# Altium schematic sheet 33-SOC_GENERAL AND MCU GENERAL.SchDoc
size 513 x 386 mm
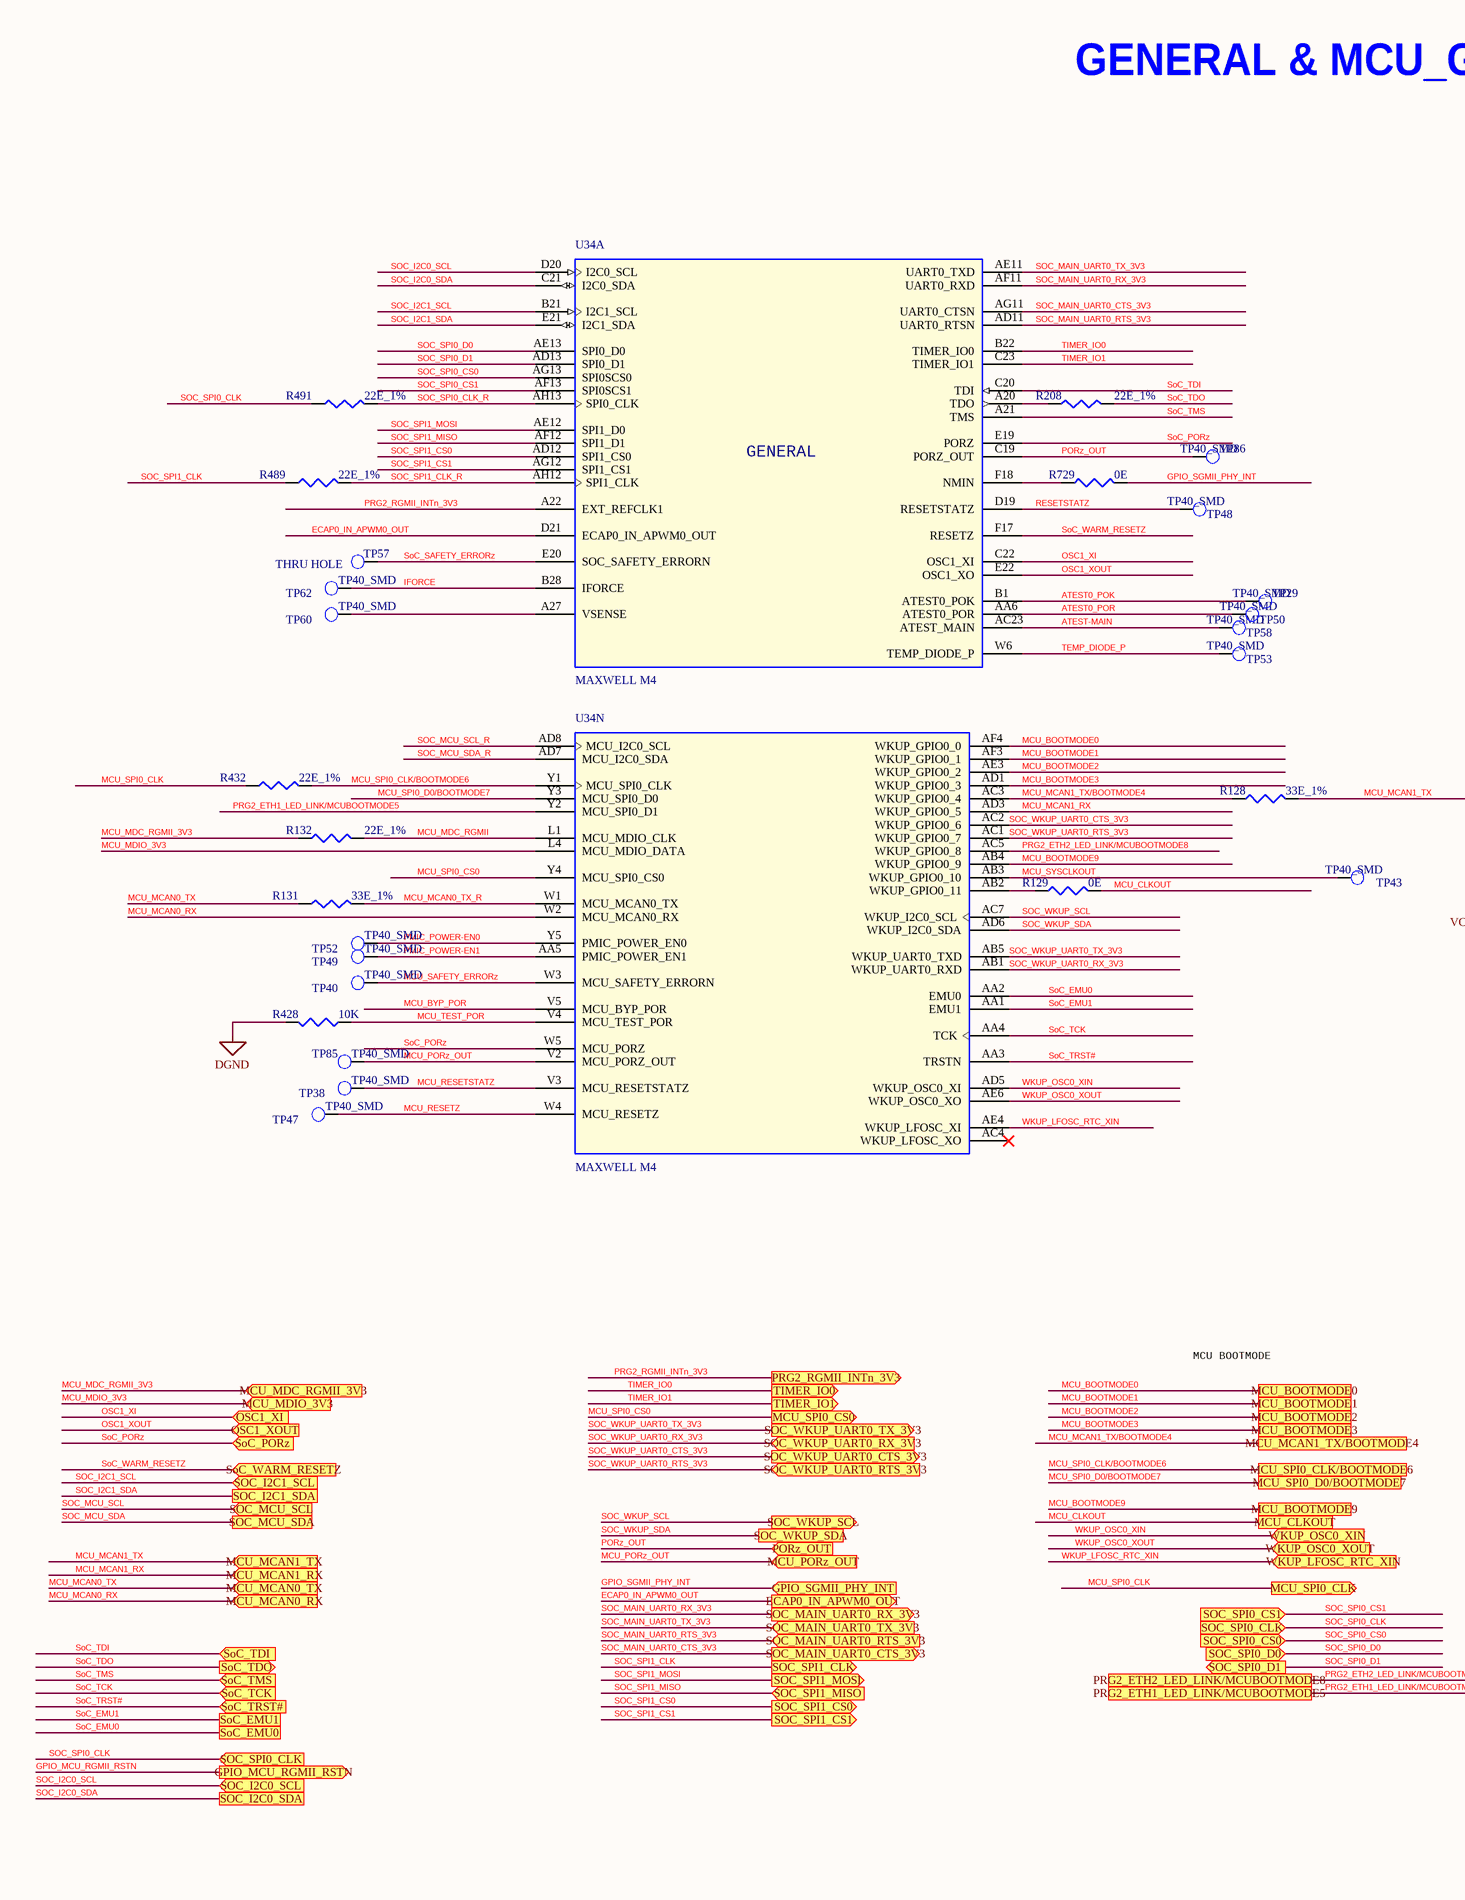
[diagram p0: 33-SOC_GENERAL AND MCU GENERAL.SchDoc, left]
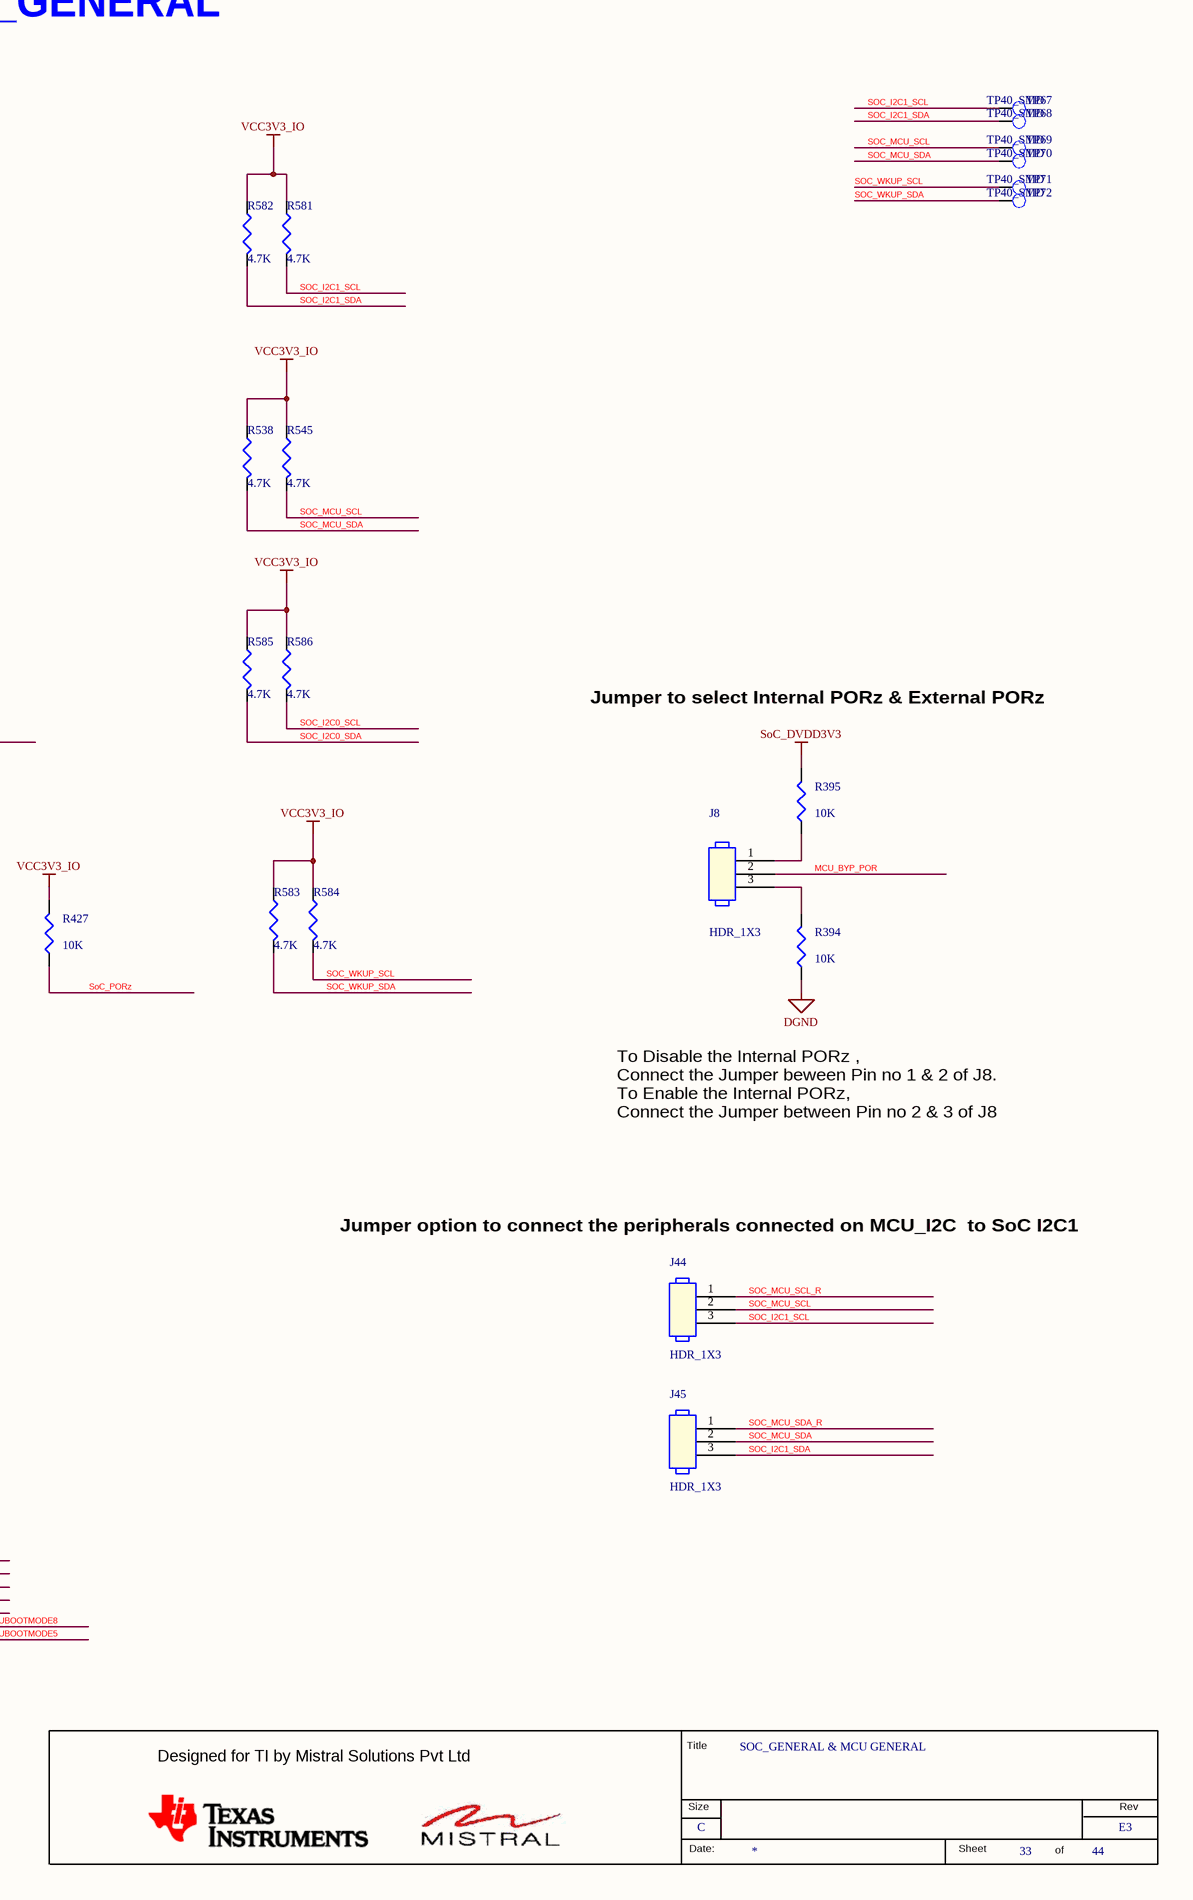
[diagram p1: 33-SOC_GENERAL AND MCU GENERAL.SchDoc, right]

## Parts
*  RevCode: E3  Title: SOC_GENERAL & MCU GENERAL  Page Size: C  Page Number: 33  Page Count: 44  (hidden comment: MISTRAL_TITLEBLK_CSIZE)  (graphical)
J8  HDR_1X3  [HDR_3X1_100_S_T]
J44  HDR_1X3  [HDR_3X1_100_S_T]
J45  HDR_1X3  [HDR_3X1_100_S_T]
R128  33E_1%  [RES0402_0-5]
R129  0E  [RES0402_0-5]
R131  33E_1%  [RES0402_0-5]
R132  22E_1%  [RES0402]
R208  22E_1%  [RES0402]
R394  10K  [RES0402_0-5]
R395  10K  [RES0402_0-5]
R427  10K  [RES0402_0-5]
R428  10K  [RES0402_0-5]
R432  22E_1%  [RES0402]
R489  22E_1%  [RES0402]
R491  22E_1%  [RES0402]
R538  4.7K  [RES0402]
R545  4.7K  [RES0402]
R581  4.7K  [RES0402]
R582  4.7K  [RES0402]
R583  4.7K  [RES0402]
R584  4.7K  [RES0402]
R585  4.7K  [RES0402]
R586  4.7K  [RES0402]
R729  0E  [RES0402_0-5]
TP29  TP40_SMD  [TP40_SMD]
TP38  TP40_SMD  [TP40_SMD]
TP40  TP40_SMD  [TP40_SMD]
TP43  TP40_SMD  [TP40_SMD]
TP47  TP40_SMD  [TP40_SMD]
TP48  TP40_SMD  [TP40_SMD]
TP49  TP40_SMD  [TP40_SMD]
TP50  TP40_SMD  [TP40_SMD]
TP52  TP40_SMD  [TP40_SMD]
TP53  TP40_SMD  [TP40_SMD]
TP57  THRU HOLE  [TP_40X65]
TP58  TP40_SMD  [TP40_SMD]
TP60  TP40_SMD  [TP40_SMD]
TP62  TP40_SMD  [TP40_SMD]
TP67  TP40_SMD  [TP40_SMD]
TP68  TP40_SMD  [TP40_SMD]
TP69  TP40_SMD  [TP40_SMD]
TP70  TP40_SMD  [TP40_SMD]
TP71  TP40_SMD  [TP40_SMD]
TP72  TP40_SMD  [TP40_SMD]
TP85  TP40_SMD  [TP40_SMD]
TP86  TP40_SMD  [TP40_SMD]
U34  MAXWELL M4  [BGA784_31-49_910X910_1-7]  (parts A,N of 19)

## Ports
ECAP0_IN_APWM0_OUT (out), GPIO_MCU_RGMII_RSTN (out), GPIO_SGMII_PHY_INT (in), MCU_BOOTMODE0, MCU_BOOTMODE1, MCU_BOOTMODE2, MCU_BOOTMODE3, MCU_BOOTMODE9, MCU_CLKOUT, MCU_MCAN0_RX (in), MCU_MCAN0_TX (in), MCU_MCAN1_RX (in), MCU_MCAN1_TX (in), MCU_MCAN1_TX/BOOTMODE4, MCU_MDC_RGMII_3V3 (in), MCU_MDIO_3V3 (in), MCU_PORz_OUT (in), MCU_SPI0_CLK (out), MCU_SPI0_CLK/BOOTMODE6, MCU_SPI0_CS0 (out), MCU_SPI0_D0/BOOTMODE7, OSC1_XI (in), OSC1_XOUT (in), PORz_OUT (in), PRG2_ETH1_LED_LINK/MCUBOOTMODE5, PRG2_ETH2_LED_LINK/MCUBOOTMODE8, PRG2_RGMII_INTn_3V3 (out), SoC_EMU0, SoC_EMU1, SOC_I2C0_SCL (in), SOC_I2C0_SDA, SOC_I2C1_SCL (in), SOC_I2C1_SDA, SOC_MAIN_UART0_CTS_3V3 (out), SOC_MAIN_UART0_RTS_3V3 (in), SOC_MAIN_UART0_RX_3V3 (out), SOC_MAIN_UART0_TX_3V3 (in), SOC_MCU_SCL (in), SOC_MCU_SDA, SoC_PORz (in), SOC_SPI0_CLK (in), SOC_SPI0_CS0 (in), SOC_SPI0_CS1 (in), SOC_SPI0_D0 (in), SOC_SPI0_D1 (out), SOC_SPI1_CLK (out), SOC_SPI1_CS0 (out), SOC_SPI1_CS1 (out), SOC_SPI1_MISO (in), SOC_SPI1_MOSI (out), SoC_TCK (in), SoC_TDI (in), SoC_TDO (out), SoC_TMS (in), SoC_TRST# (in), SoC_WARM_RESETZ (in), SOC_WKUP_SCL (out), SOC_WKUP_SDA, SOC_WKUP_UART0_CTS_3V3 (out), SOC_WKUP_UART0_RTS_3V3 (in), SOC_WKUP_UART0_RX_3V3 (in), SOC_WKUP_UART0_TX_3V3 (out), TIMER_IO0 (out), TIMER_IO1 (out), WKUP_LFOSC_RTC_XIN (in), WKUP_OSC0_XIN (in), WKUP_OSC0_XOUT (in)

## Nets
DGND: R394.1 R428.2
SoC_DVDD3V3: R395.2
VCC3V3_IO: R427.2 R538.1 R545.1 R581.1 R582.1 R583.1 R584.1 R585.1 R586.1
ATEST0_POK: TP29.1(TP) U34.B1(ATEST0_POK)
ATEST0_POR: TP50.1(TP) U34.AA6(ATEST0_POR)
ATEST-MAIN: TP58.1(TP) U34.AC23(ATEST_MAIN)
ECAP0_IN_APWM0_OUT: U34.D21(ECAP0_IN_APWM0_OUT) ; port ECAP0_IN_APWM0_OUT
GPIO_MCU_RGMII_RSTN: port GPIO_MCU_RGMII_RSTN
GPIO_SGMII_PHY_INT: R729.2 ; port GPIO_SGMII_PHY_INT
IFORCE: TP62.1(TP) U34.B28(IFORCE)
MCU_BOOTMODE0: U34.AF4(WKUP_GPIO0_0) ; port MCU_BOOTMODE0
MCU_BOOTMODE1: U34.AF3(WKUP_GPIO0_1) ; port MCU_BOOTMODE1
MCU_BOOTMODE2: U34.AE3(WKUP_GPIO0_2) ; port MCU_BOOTMODE2
MCU_BOOTMODE3: U34.AD1(WKUP_GPIO0_3) ; port MCU_BOOTMODE3
MCU_BOOTMODE9: U34.AB4(WKUP_GPIO0_9) ; port MCU_BOOTMODE9
MCU_BYP_POR: J8.2 U34.V5(MCU_BYP_POR)
MCU_CLKOUT: R129.2 ; port MCU_CLKOUT
MCU_MCAN0_RX: U34.W2(MCU_MCAN0_RX) ; port MCU_MCAN0_RX
MCU_MCAN0_TX: R131.1 ; port MCU_MCAN0_TX
MCU_MCAN0_TX_R: R131.2 U34.W1(MCU_MCAN0_TX)
MCU_MCAN1_RX: U34.AD3(WKUP_GPIO0_5) ; port MCU_MCAN1_RX
MCU_MCAN1_TX: R128.2 ; port MCU_MCAN1_TX
MCU_MCAN1_TX/BOOTMODE4: R128.1 U34.AC3(WKUP_GPIO0_4) ; port MCU_MCAN1_TX/BOOTMODE4
MCU_MDC_RGMII: R132.2 U34.L1(MCU_MDIO_CLK)
MCU_MDC_RGMII_3V3: R132.1 ; port MCU_MDC_RGMII_3V3
MCU_MDIO_3V3: U34.L4(MCU_MDIO_DATA) ; port MCU_MDIO_3V3
MCU_PORz_OUT: TP85.1(TP) U34.V2(MCU_PORZ_OUT) ; port MCU_PORz_OUT
MCU_RESETSTATZ: TP38.1(TP) U34.V3(MCU_RESETSTATZ)
MCU_RESETZ: TP47.1(TP) U34.W4(MCU_RESETZ)
MCU_SAFETY_ERRORz: TP40.1(TP) U34.W3(MCU_SAFETY_ERRORN)
MCU_SPI0_CLK: R432.1 ; port MCU_SPI0_CLK
MCU_SPI0_CLK/BOOTMODE6: R432.2 U34.Y1(MCU_SPI0_CLK) ; port MCU_SPI0_CLK/BOOTMODE6
MCU_SPI0_CS0: U34.Y4(MCU_SPI0_CS0) ; port MCU_SPI0_CS0
MCU_SPI0_D0/BOOTMODE7: U34.Y3(MCU_SPI0_D0) ; port MCU_SPI0_D0/BOOTMODE7
MCU_SYSCLKOUT: TP43.1(TP) U34.AB3(WKUP_GPIO0_10)
MCU_TEST_POR: R428.1 U34.V4(MCU_TEST_POR)
OSC1_XI: U34.C22(OSC1_XI) ; port OSC1_XI
OSC1_XOUT: U34.E22(OSC1_XO) ; port OSC1_XOUT
PMIC_POWER-EN0: TP52.1(TP) U34.Y5(PMIC_POWER_EN0)
PMIC_POWER-EN1: TP49.1(TP) U34.AA5(PMIC_POWER_EN1)
PORz_OUT: TP86.1(TP) U34.C19(PORZ_OUT) ; port PORz_OUT
PRG2_ETH1_LED_LINK/MCUBOOTMODE5: U34.Y2(MCU_SPI0_D1) ; port PRG2_ETH1_LED_LINK/MCUBOOTMODE5
PRG2_ETH2_LED_LINK/MCUBOOTMODE8: U34.AC5(WKUP_GPIO0_8) ; port PRG2_ETH2_LED_LINK/MCUBOOTMODE8
PRG2_RGMII_INTn_3V3: U34.A22(EXT_REFCLK1) ; port PRG2_RGMII_INTn_3V3
RESETSTATZ: TP48.1(TP) U34.D19(RESETSTATZ)
SoC_EMU0: U34.AA2(EMU0) ; port SoC_EMU0
SoC_EMU1: U34.AA1(EMU1) ; port SoC_EMU1
SOC_I2C0_SCL: R586.2 U34.D20(I2C0_SCL) ; port SOC_I2C0_SCL
SOC_I2C0_SDA: R585.2 U34.C21(I2C0_SDA) ; port SOC_I2C0_SDA
SOC_I2C1_SCL: J44.3 R581.2 TP67.1(TP) U34.B21(I2C1_SCL) ; port SOC_I2C1_SCL
SOC_I2C1_SDA: J45.3 R582.2 TP68.1(TP) U34.E21(I2C1_SDA) ; port SOC_I2C1_SDA
SOC_MAIN_UART0_CTS_3V3: U34.AG11(UART0_CTSN) ; port SOC_MAIN_UART0_CTS_3V3
SOC_MAIN_UART0_RTS_3V3: U34.AD11(UART0_RTSN) ; port SOC_MAIN_UART0_RTS_3V3
SOC_MAIN_UART0_RX_3V3: U34.AF11(UART0_RXD) ; port SOC_MAIN_UART0_RX_3V3
SOC_MAIN_UART0_TX_3V3: U34.AE11(UART0_TXD) ; port SOC_MAIN_UART0_TX_3V3
SOC_MCU_SCL: J44.2 R545.2 TP69.1(TP) ; port SOC_MCU_SCL
SOC_MCU_SCL_R: J44.1 U34.AD8(MCU_I2C0_SCL)
SOC_MCU_SDA: J45.2 R538.2 TP70.1(TP) ; port SOC_MCU_SDA
SOC_MCU_SDA_R: J45.1 U34.AD7(MCU_I2C0_SDA)
SoC_PORz: R427.1 U34.E19(PORZ) U34.W5(MCU_PORZ) ; port SoC_PORz
SoC_SAFETY_ERRORz: TP57.1(TP) U34.E20(SOC_SAFETY_ERRORN)
SOC_SPI0_CLK: R491.1 ; port SOC_SPI0_CLK
SOC_SPI0_CLK_R: R491.2 U34.AH13(SPI0_CLK)
SOC_SPI0_CS0: U34.AG13(SPI0SCS0) ; port SOC_SPI0_CS0
SOC_SPI0_CS1: U34.AF13(SPI0SCS1) ; port SOC_SPI0_CS1
SOC_SPI0_D0: U34.AE13(SPI0_D0) ; port SOC_SPI0_D0
SOC_SPI0_D1: U34.AD13(SPI0_D1) ; port SOC_SPI0_D1
SOC_SPI1_CLK: R489.1 ; port SOC_SPI1_CLK
SOC_SPI1_CLK_R: R489.2 U34.AH12(SPI1_CLK)
SOC_SPI1_CS0: U34.AD12(SPI1_CS0) ; port SOC_SPI1_CS0
SOC_SPI1_CS1: U34.AG12(SPI1_CS1) ; port SOC_SPI1_CS1
SOC_SPI1_MISO: U34.AF12(SPI1_D1) ; port SOC_SPI1_MISO
SOC_SPI1_MOSI: U34.AE12(SPI1_D0) ; port SOC_SPI1_MOSI
SoC_TCK: U34.AA4(TCK) ; port SoC_TCK
SoC_TDI: U34.C20(TDI) ; port SoC_TDI
SoC_TDO: R208.2 ; port SoC_TDO
SoC_TMS: U34.A21(TMS) ; port SoC_TMS
SoC_TRST#: U34.AA3(TRSTN) ; port SoC_TRST#
SoC_WARM_RESETZ: U34.F17(RESETZ) ; port SoC_WARM_RESETZ
SOC_WKUP_SCL: R584.2 TP71.1(TP) U34.AC7(WKUP_I2C0_SCL) ; port SOC_WKUP_SCL
SOC_WKUP_SDA: R583.2 TP72.1(TP) U34.AD6(WKUP_I2C0_SDA) ; port SOC_WKUP_SDA
SOC_WKUP_UART0_CTS_3V3: U34.AC2(WKUP_GPIO0_6) ; port SOC_WKUP_UART0_CTS_3V3
SOC_WKUP_UART0_RTS_3V3: U34.AC1(WKUP_GPIO0_7) ; port SOC_WKUP_UART0_RTS_3V3
SOC_WKUP_UART0_RX_3V3: U34.AB1(WKUP_UART0_RXD) ; port SOC_WKUP_UART0_RX_3V3
SOC_WKUP_UART0_TX_3V3: U34.AB5(WKUP_UART0_TXD) ; port SOC_WKUP_UART0_TX_3V3
TEMP_DIODE_P: TP53.1(TP) U34.W6(TEMP_DIODE_P)
TIMER_IO0: U34.B22(TIMER_IO0) ; port TIMER_IO0
TIMER_IO1: U34.C23(TIMER_IO1) ; port TIMER_IO1
WKUP_LFOSC_RTC_XIN: U34.AE4(WKUP_LFOSC_XI) ; port WKUP_LFOSC_RTC_XIN
WKUP_OSC0_XIN: U34.AD5(WKUP_OSC0_XI) ; port WKUP_OSC0_XIN
WKUP_OSC0_XOUT: U34.AE6(WKUP_OSC0_XO) ; port WKUP_OSC0_XOUT
NetJ8_1: J8.1 R395.1
NetJ8_3: J8.3 R394.2
NetR129_1: R129.1 U34.AB2(WKUP_GPIO0_11)
NetR208_1: R208.1 U34.A20(TDO)
NetR729_1: R729.1 U34.F18(NMIN)
NetTP60_1: TP60.1(TP) U34.A27(VSENSE)

Not connected (* = marked no-connect by the designer): U34 AC4(WKUP_LFOSC_XO)*

## Notes on the sheet
- GENERAL & MCU_GENERAL
- Jumper to select Internal PORz & External PORz
- To Disable the Internal PORz ,
  Connect the Jumper beween Pin no 1 & 2 of J8.
  To Enable the Internal PORz,
  Connect the Jumper between Pin no 2 & 3 of J8
- Jumper option to connect the peripherals connected on MCU_I2C  to SoC I2C1
- MCU BOOTMODE
- (in symbol AM654X_BGA784, part A) GENERAL
- (in symbol MISTRAL_TITLEBLK_CSIZE) Title; Designed for TI by Mistral Solutions Pvt Ltd; Size; Rev; Date:; Sheet; of

## Library data of the parts
* = MISTRAL_TITLEBLK_CSIZE: Issue: 1.0; Page Create Date: March  8, 1995; Page Modify Date: *
J8 J44 = HEADER_3X1: HDR 1X3 2.54MM PITCH ST TH; Part_type: CONNECTOR\HEADERS; Mfr_part_number: 68001-403HLF; Mfr_name: FCI; Mistral Part No: 150016060025-R; Custom_Duty: 15%; Customs_HS_Code: 85322990; Wattage: NA; Project: IKEYP; Chkd/date: VASANTHA/290616; Crtd /date: VASANTHA/290616; Datasheet: Y:\MIS_DATABASE\DATASHEETS\CONNECTORS\68000.PDF; Temperature: -40°C+105°C; Weight: NA; Height: 8.58MM; Distributor_part_number: 609-3471-ND; Distributor_name: DIGIKEY; Package: THRU-HOLE; Voltage: NA; Tolerance: NA; PCB Footprint: HDR_3X1_100_S_T; Library Ref: HEADER_3X1
J45 = HEADER_3X1: HDR 1X3 2.54MM PITCH ST TH; Mistral Part No: 150016060025-R; Mfr_name: FCI; Mfr_part_number: 68001-403HLF; Part_type: CONNECTOR\HEADERS; Project: IKEYP; Tolerance: NA; Customs_HS_Code: 85322990; Custom_Duty: 15%; Library Ref: HEADER_3X1; Voltage: NA; Wattage: NA; Package: THRU-HOLE; Distributor_name: DIGIKEY; Distributor_part_number: 609-3471-ND; Height: 8.58MM; Weight: NA; Temperature: -40°C+105°C; Datasheet: Y:\MIS_DATABASE\DATASHEETS\CONNECTORS\68000.PDF; Crtd /date: VASANTHA/290616; Chkd/date: VASANTHA/290616; PCB Footprint: HDR_3X1_100_S_T
R128 = RESISTOR_Dup5: RES 33E 1/16W 1% 0402; Part_type: RESISTORS\FIXED; Mfr_part_number: ERJ-2RKF33R0X; Mfr_name: PANASONIC-ECG; Mistral Part No: 110014110006-R; Custom_Duty: 15%; Customs_HS_Code: 85332119; Voltage: NA; Project: ZK BIOMETRIC; PCB Footprint: RES0402_0-5; MECHANICAL 3D STEP FILE: RES0402_0-5; Chkd/date: VASANTHA/061216; Crtd /date: JEBRAN/171114; Datasheet: Y:\MIS_DATABASE\DATASHEETS\RESISTORS\PAN-ERJSERIES.PDF; Temperature: -55°C+125°C; Weight: 0.8g/1000pcs; Height: 0.40MM; Distributor_part_number: P33.0LCT-ND; Distributor_name: DIGIKEY; Package: 0402; Wattage: 1/16W; Tolerance: 1%; Library Ref: RESISTOR
R129 = RESISTOR_Dup4: RES 0E 1/16W 0402; Mistral Part No: 110010080019-P; Mfr_name: VISHAY; Mfr_part_number: CRCW04020000Z0ED; Part_type: RESISTORS\FIXED; Project: PB_BUGBASE; Tolerance: NA; Customs_HS_Code: 85332119; Custom_Duty: 15%; NI_MARK: DNI; Voltage: NA; Wattage: 1/16W; Package: 0402; Distributor_name: DIGIKEY; Distributor_part_number: 541-0.0JCT-ND; Height: 0.40MM; Weight: 0.65g/1000pcs; Temperature: -55°C+155°C; Datasheet: Y:\MIS_DATABASE\DATASHEETS\RESISTORS\CRCW0603.PDF; Crtd /date: MUDDU/190810; Chkd/date: VASANTHA/201216; RoHS: Pb-Free; MECHANICAL 3D STEP FILE: RES0402_0-5; PCB Footprint: RES0402_0-5; Library Ref: RESISTOR; Footprint Ref: RES0402_0-5; Library Path: Y:\MIS_DATABASE\Library\ALTIUM_TOOL\SCHEMATICS_PARTS\MS_DISCRETE_Library.schlib; Footprint Path: Y:\MIS_DATABASE\Library\ALTIUM_TOOL\PCB_FOOTPRINTS\Altium_Footprint_Lib.PcbLib
R131 = RESISTOR_Dup5: RES 33E 1/16W 1% 0402; Mistral Part No: 110014110006-R; Mfr_name: PANASONIC-ECG; Mfr_part_number: ERJ-2RKF33R0X; Part_type: RESISTORS\FIXED; Project: ZK BIOMETRIC; Voltage: NA; Customs_HS_Code: 85332119; Custom_Duty: 15%; Tolerance: 1%; Wattage: 1/16W; Package: 0402; Distributor_name: DIGIKEY; Distributor_part_number: P33.0LCT-ND; Height: 0.40MM; Weight: 0.8g/1000pcs; Temperature: -55°C+125°C; Datasheet: Y:\MIS_DATABASE\DATASHEETS\RESISTORS\PAN-ERJSERIES.PDF; Crtd /date: JEBRAN/171114; Chkd/date: VASANTHA/061216; MECHANICAL 3D STEP FILE: RES0402_0-5; PCB Footprint: RES0402_0-5; Library Ref: RESISTOR
R132 = RESISTOR_Dup5: RES 22E 1/16W 1% 0402; Mistral Part No: 110009090004-P; Mfr_name: YAGEO AMERICA; Mfr_part_number: RC0402FR-0722RL; Part_type: RESISTORS\FIXED; Alternate_mfr_name_A: VISHAY; Alternate_mfr_part_number_A: CRCW040222R0FKED; Cust_part_number: 4700-80047E; Project: VMEFMCD; Voltage: 50V; Customs_HS_Code: 85332119; Custom_Duty: 15%; Remarks: In alternate datasheet it is RoHS COMPLIANT. Y:\MIS_DATABASE\DATASHEETS\RESISTORS\CRCW0402.PDF; PCB Footprint: RES0402; Tolerance: 1%; Wattage: 1/16W; Package: 0402; Distributor_name: DIGIKEY; Distributor_part_number: 311-22.0LRCT-ND; Distributor_name_A: DIGIKEY; Distributor_part_number_A: 541-22.0LCT-ND; Height: 0.40MM; Weight: 0.8g/1000pcs; Temperature: -55°C+155°C; Datasheet: Y:\MIS_DATABASE\DATASHEETS\RESISTORS\YAGEO-RC0402.PDF; Crtd /date: MAZHAR/090909; Chkd/date: SUHAS/290910; RoHS: Pb-Free; Library Ref: RESISTOR
R208 R489 R491 = RESISTOR_Dup4: RES 22E 1/16W 1% 0402; Cust_part_number: 4700-80047E; Alternate_mfr_part_number_A: CRCW040222R0FKED; Alternate_mfr_name_A: VISHAY; Part_type: RESISTORS\FIXED; Mfr_part_number: RC0402FR-0722RL; Mfr_name: YAGEO AMERICA; Mistral Part No: 110009090004-P; Remarks: In alternate datasheet it is RoHS COMPLIANT. Y:\MIS_DATABASE\DATASHEETS\RESISTORS\CRCW0402.PDF; Custom_Duty: 15%; Customs_HS_Code: 85332119; Voltage: 50V; Project: VMEFMCD; SIGNAL_MODEL: RESISTOR_RES0402_22E_22E; RoHS: Pb-Free; Chkd/date: SUHAS/290910; Crtd /date: MAZHAR/090909; Datasheet: Y:\MIS_DATABASE\DATASHEETS\RESISTORS\YAGEO-RC0402.PDF; Temperature: -55°C+155°C; Weight: 0.8g/1000pcs; Height: 0.40MM; Distributor_part_number_A: 541-22.0LCT-ND; Distributor_name_A: DIGIKEY; Distributor_part_number: 311-22.0LRCT-ND; Distributor_name: DIGIKEY; Package: 0402; Wattage: 1/16W; Tolerance: 1%; PCB Footprint: RES0402; Library Ref: RESISTOR
R394 R395 = RESISTOR_Dup5: RES 10K 1/16W 5% 0402; Part_type: RESISTORS\FIXED; Mfr_part_number: RC0402JR-0710KL; Mfr_name: YAGEO AMERICA; Mistral Part No: 110009030208-R; Custom_Duty: 15%; Customs_HS_Code: 85332119; Voltage: NA; Project: HSE; PCB Footprint: RES0402_0-5; MECHANICAL 3D STEP FILE: RES0402_0-5; RoHS: Pb-Free; Chkd/date: VASANTHA/061216; Crtd /date: MAZHAR/230805; Datasheet: Y:\MIS_DATABASE\DATASHEETS\RESISTORS\YAGEO-RC0402.PDF; Temperature: -55°C+155°C; Weight: 0.65mg; Height: 0.40MM; Distributor_part_number: 311-10KJRCT-ND; Distributor_name: DIGIKEY; Package: 0402; Wattage: 1/16W; Tolerance: 5%; Library Ref: RESISTOR; Footprint Ref: RES0402_0-5; Library Path: Y:\MIS_DATABASE\Library\ALTIUM_TOOL\SCHEMATICS_PARTS\MS_DISCRETE_Library.schlib; Footprint Path: Y:\MIS_DATABASE\Library\ALTIUM_TOOL\PCB_FOOTPRINTS\Altium_Footprint_Lib.PcbLib
R427 = RESISTOR_Dup5: RES 10K 1/16W 5% 0402; Mistral Part No: 110009030208-R; Mfr_name: YAGEO AMERICA; Mfr_part_number: RC0402JR-0710KL; Part_type: RESISTORS\FIXED; Project: HSE; Voltage: NA; Customs_HS_Code: 85332119; Custom_Duty: 15%; NI_MARK: DNI; Tolerance: 5%; Wattage: 1/16W; Package: 0402; Distributor_name: DIGIKEY; Distributor_part_number: 311-10KJRCT-ND; Height: 0.40MM; Weight: 0.65mg; Temperature: -55°C+155°C; Datasheet: Y:\MIS_DATABASE\DATASHEETS\RESISTORS\YAGEO-RC0402.PDF; Crtd /date: MAZHAR/230805; Chkd/date: VASANTHA/061216; RoHS: Pb-Free; MECHANICAL 3D STEP FILE: RES0402_0-5; PCB Footprint: RES0402_0-5; Library Ref: RESISTOR; Footprint Ref: RES0402_0-5; Library Path: Y:\MIS_DATABASE\Library\ALTIUM_TOOL\SCHEMATICS_PARTS\MS_DISCRETE_Library.schlib; Footprint Path: Y:\MIS_DATABASE\Library\ALTIUM_TOOL\PCB_FOOTPRINTS\Altium_Footprint_Lib.PcbLib
R428 = RESISTOR_Dup5: RES 10K 1/16W 5% 0402; Mistral Part No: 110009030208-R; Mfr_name: YAGEO AMERICA; Mfr_part_number: RC0402JR-0710KL; Part_type: RESISTORS\FIXED; Project: HSE; Voltage: NA; Customs_HS_Code: 85332119; Custom_Duty: 15%; PCB Footprint: RES0402_0-5; Tolerance: 5%; Wattage: 1/16W; Package: 0402; Distributor_name: DIGIKEY; Distributor_part_number: 311-10KJRCT-ND; Height: 0.40MM; Weight: 0.65mg; Temperature: -55°C+155°C; Datasheet: Y:\MIS_DATABASE\DATASHEETS\RESISTORS\YAGEO-RC0402.PDF; Crtd /date: MAZHAR/230805; Chkd/date: VASANTHA/061216; RoHS: Pb-Free; MECHANICAL 3D STEP FILE: RES0402_0-5; Library Ref: RESISTOR; Footprint Ref: RES0402_0-5; Library Path: Y:\MIS_DATABASE\Library\ALTIUM_TOOL\SCHEMATICS_PARTS\MS_DISCRETE_Library.schlib; Footprint Path: Y:\MIS_DATABASE\Library\ALTIUM_TOOL\PCB_FOOTPRINTS\Altium_Footprint_Lib.PcbLib
R432 = RESISTOR_Dup4: RES 22E 1/16W 1% 0402; Mistral Part No: 110009090004-P; Mfr_name: YAGEO AMERICA; Mfr_part_number: RC0402FR-0722RL; Part_type: RESISTORS\FIXED; Alternate_mfr_name_A: VISHAY; Alternate_mfr_part_number_A: CRCW040222R0FKED; Cust_part_number: 4700-80047E; SIGNAL_MODEL: RESISTOR_RES0402_22E_22E; Project: VMEFMCD; Voltage: 50V; Customs_HS_Code: 85332119; Custom_Duty: 15%; Remarks: In alternate datasheet it is RoHS COMPLIANT. Y:\MIS_DATABASE\DATASHEETS\RESISTORS\CRCW0402.PDF; Library Ref: RESISTOR; Tolerance: 1%; Wattage: 1/16W; Package: 0402; Distributor_name: DIGIKEY; Distributor_part_number: 311-22.0LRCT-ND; Distributor_name_A: DIGIKEY; Distributor_part_number_A: 541-22.0LCT-ND; Height: 0.40MM; Weight: 0.8g/1000pcs; Temperature: -55°C+155°C; Datasheet: Y:\MIS_DATABASE\DATASHEETS\RESISTORS\YAGEO-RC0402.PDF; Crtd /date: MAZHAR/090909; Chkd/date: SUHAS/290910; RoHS: Pb-Free; PCB Footprint: RES0402
R538 R582 R584 R585 = RESISTOR_Dup5: RES 4.7K 1/16W 5% 0402; Part_type: RESISTORS\FIXED; Mfr_part_number: RC0402JR-074K7L; Mfr_name: YAGEO AMERICA; Mistral Part No: 110009030792-R; Custom_Duty: 15%; Customs_HS_Code: 85332119; Voltage: NA; Project: TMDXCSK368; Chkd/date: VASANTHA/130516; Crtd /date: VASANTHA/130516; Datasheet: Y:\MIS_DATABASE\DATASHEETS\RESISTORS\YAGEO-RC0402.PDF; Temperature: -55°C+155°C; Weight: NA; Height: 0.55MM; Distributor_part_number: 311-4.7KJRCT-ND; Distributor_name: DIGIKEY; Package: 0402; Wattage: 1/16W; Tolerance: 5%; PCB Footprint: RES0402; Library Ref: RESISTOR
R545 R581 R583 R586 = RESISTOR_Dup5: RES 4.7K 1/16W 5% 0402; Mistral Part No: 110009030792-R; Mfr_name: YAGEO AMERICA; Mfr_part_number: RC0402JR-074K7L; Part_type: RESISTORS\FIXED; Project: TMDXCSK368; Voltage: NA; Customs_HS_Code: 85332119; Custom_Duty: 15%; Tolerance: 5%; Wattage: 1/16W; Package: 0402; Distributor_name: DIGIKEY; Distributor_part_number: 311-4.7KJRCT-ND; Height: 0.55MM; Weight: NA; Temperature: -55°C+155°C; Datasheet: Y:\MIS_DATABASE\DATASHEETS\RESISTORS\YAGEO-RC0402.PDF; Crtd /date: VASANTHA/130516; Chkd/date: VASANTHA/130516; PCB Footprint: RES0402; Library Ref: RESISTOR
R729 = RESISTOR_Dup5: RES 0E 1/16W 0402; Part_type: RESISTORS\FIXED; Mfr_part_number: CRCW04020000Z0ED; Mfr_name: VISHAY; Mistral Part No: 110010080019-P; Custom_Duty: 15%; Customs_HS_Code: 85332119; Voltage: NA; Project: PB_BUGBASE; PCB Footprint: RES0402_0-5; MECHANICAL 3D STEP FILE: RES0402_0-5; RoHS: Pb-Free; Chkd/date: VASANTHA/201216; Crtd /date: MUDDU/190810; Datasheet: Y:\MIS_DATABASE\DATASHEETS\RESISTORS\CRCW0603.PDF; Temperature: -55°C+155°C; Weight: 0.65g/1000pcs; Height: 0.40MM; Distributor_part_number: 541-0.0JCT-ND; Distributor_name: DIGIKEY; Package: 0402; Wattage: 1/16W; Tolerance: NA; Library Ref: RESISTOR; Footprint Ref: RES0402_0-5; Library Path: Y:\MIS_DATABASE\Library\ALTIUM_TOOL\SCHEMATICS_PARTS\MS_DISCRETE_Library.schlib; Footprint Path: Y:\MIS_DATABASE\Library\ALTIUM_TOOL\PCB_FOOTPRINTS\Altium_Footprint_Lib.PcbLib
TP29 TP38 TP40 TP47 TP48 TP52 TP67 TP70 TP71 TP85 = TESTPOINT: TESTPOINT CIR 40 SMD; Mistral Part No: 130009030933; Mfr_name: LOCAL; Project: RAINIER-3; Tolerance: NA; NI_MARK: DNI; Mfr_part_number: TP40_SMD; Part_type: TESTPOINT; Package: SMD; Distributor_name: NA; Distributor_part_number: NA; Height: NA; Crtd /date: MAZHAR/190505; Chkd/date: MAZHAR/190505; Voltage: NA; Wattage: NA; Weight: NA; Temperature: NA; Datasheet: NA; MECHANICAL 3D STEP FILE: NA; Library Path: Y:\MIS_DATABASE\Library\ALTIUM_TOOL\SCHEMATICS_PARTS\MS_DISCRETE_Library.schlib; Footprint Path: Y:\MIS_DATABASE\Library\ALTIUM_TOOL\PCB_FOOTPRINTS\Altium_Footprint_Lib.PcbLib; PCB Footprint: TP40_SMD; Library Ref: TESTPOINT; Footprint Ref: TP40_SMD; RoHS: NA
TP43 = TESTPOINT: TESTPOINT CIR 40 SMD; Mfr_name: LOCAL; Mistral Part No: 130009030933; Project: RAINIER-3; Tolerance: NA; NI_MARK: DNI; Chkd/date: MAZHAR/190505; Crtd /date: MAZHAR/190505; Height: NA; Distributor_part_number: NA; Distributor_name: NA; Package: SMD; Part_type: TESTPOINT; Mfr_part_number: TP40_SMD; Voltage: NA; Wattage: NA; Weight: NA; Temperature: NA; Datasheet: NA; MECHANICAL 3D STEP FILE: NA; Library Path: Y:\MIS_DATABASE\Library\ALTIUM_TOOL\SCHEMATICS_PARTS\MS_DISCRETE_Library.schlib; Footprint Path: Y:\MIS_DATABASE\Library\ALTIUM_TOOL\PCB_FOOTPRINTS\Altium_Footprint_Lib.PcbLib; PCB Footprint: TP40_SMD; Library Ref: TESTPOINT; Footprint Ref: TP40_SMD; RoHS: NA
TP49 TP50 TP53 TP62 TP68 TP69 TP72 TP86 = TESTPOINT: TESTPOINT CIR 40 SMD; Mfr_name: LOCAL; Mistral Part No: 130009030933; MECHANICAL 3D STEP FILE: NA; Project: RAINIER-3; NI_MARK: DNI; PCB Footprint: TP40_SMD; Footprint Path: Y:\MIS_DATABASE\Library\ALTIUM_TOOL\PCB_FOOTPRINTS\Altium_Footprint_Lib.PcbLib; Library Path: Y:\MIS_DATABASE\Library\ALTIUM_TOOL\SCHEMATICS_PARTS\MS_DISCRETE_Library.schlib; Datasheet: NA; Temperature: NA; Weight: NA; Wattage: NA; Voltage: NA; Tolerance: NA; Chkd/date: MAZHAR/190505; Crtd /date: MAZHAR/190505; Height: NA; Distributor_part_number: NA; Distributor_name: NA; Package: SMD; Part_type: TESTPOINT; Mfr_part_number: TP40_SMD; Library Ref: TESTPOINT; Footprint Ref: TP40_SMD; RoHS: NA
TP57 = TESTPOINT: TESTPOINT 1.0MM DRILL PTH; Part_type: MISC\TESTPOINT; Mfr_name: LOCAL; Mistral Part No: 130009030938; Project: HSE; NI_MARK: DNI; PCB Footprint: TP_40X65; Chkd/date: MAZHAR/271211; Crtd /date: SHREESHAIL/041005; Datasheet: NA; Height: NA; Distributor_part_number: NA; Distributor_name: NA; Package: THRU-HOLE; Mfr_part_number: TP_40X65; Library Ref: TESTPOINT
TP58 TP60 = TESTPOINT: TESTPOINT CIR 40 SMD; Mistral Part No: 130009030933; Mfr_name: LOCAL; MECHANICAL 3D STEP FILE: NA; Project: RAINIER-3; NI_MARK: DNI; PCB Footprint: TP40_SMD; Footprint Path: Y:\MIS_DATABASE\Library\ALTIUM_TOOL\PCB_FOOTPRINTS\Altium_Footprint_Lib.PcbLib; Library Path: Y:\MIS_DATABASE\Library\ALTIUM_TOOL\SCHEMATICS_PARTS\MS_DISCRETE_Library.schlib; Datasheet: NA; Temperature: NA; Weight: NA; Wattage: NA; Voltage: NA; Tolerance: NA; Mfr_part_number: TP40_SMD; Part_type: TESTPOINT; Package: SMD; Distributor_name: NA; Distributor_part_number: NA; Height: NA; Crtd /date: MAZHAR/190505; Chkd/date: MAZHAR/190505; Library Ref: TESTPOINT; Footprint Ref: TP40_SMD; RoHS: NA
U34 = AM654X_BGA784: IC MAXWELL MICRO CONTROLLER UNIT BGA784; Mistral Part No: 141217100003; Mfr_name: TEXAS INSTRUMENTS; Mfr_part_number: MAXWELL M4_EVM; Part_type: ICS\DIGITAL\MICROCONTROLLER; Project: TI_MAXIE_CPB; Tolerance: NA; Customs_HS_Code: 85423100; Custom_Duty: 15%; PCB Footprint: BGA784_31-49_910X910_1-7; Voltage: NA; Wattage: NA; Package: BGA784; Distributor_name: NA; Distributor_part_number: NA; Height: 1.63MM; Weight: NA; Temperature: NA; Datasheet: Y:\MIS_DATABASE\DATASHEETS\ICS\DIGITAL\MICROCONTROLLER\MAXWELLM4.PDF; Crtd /date: MANIRAJA/130717; Chkd/date: MANIRAJA/130717; MECHANICAL 3D STEP FILE: BGA784_31-49_910X910_1-7; Library Ref: AM654X_BGA784